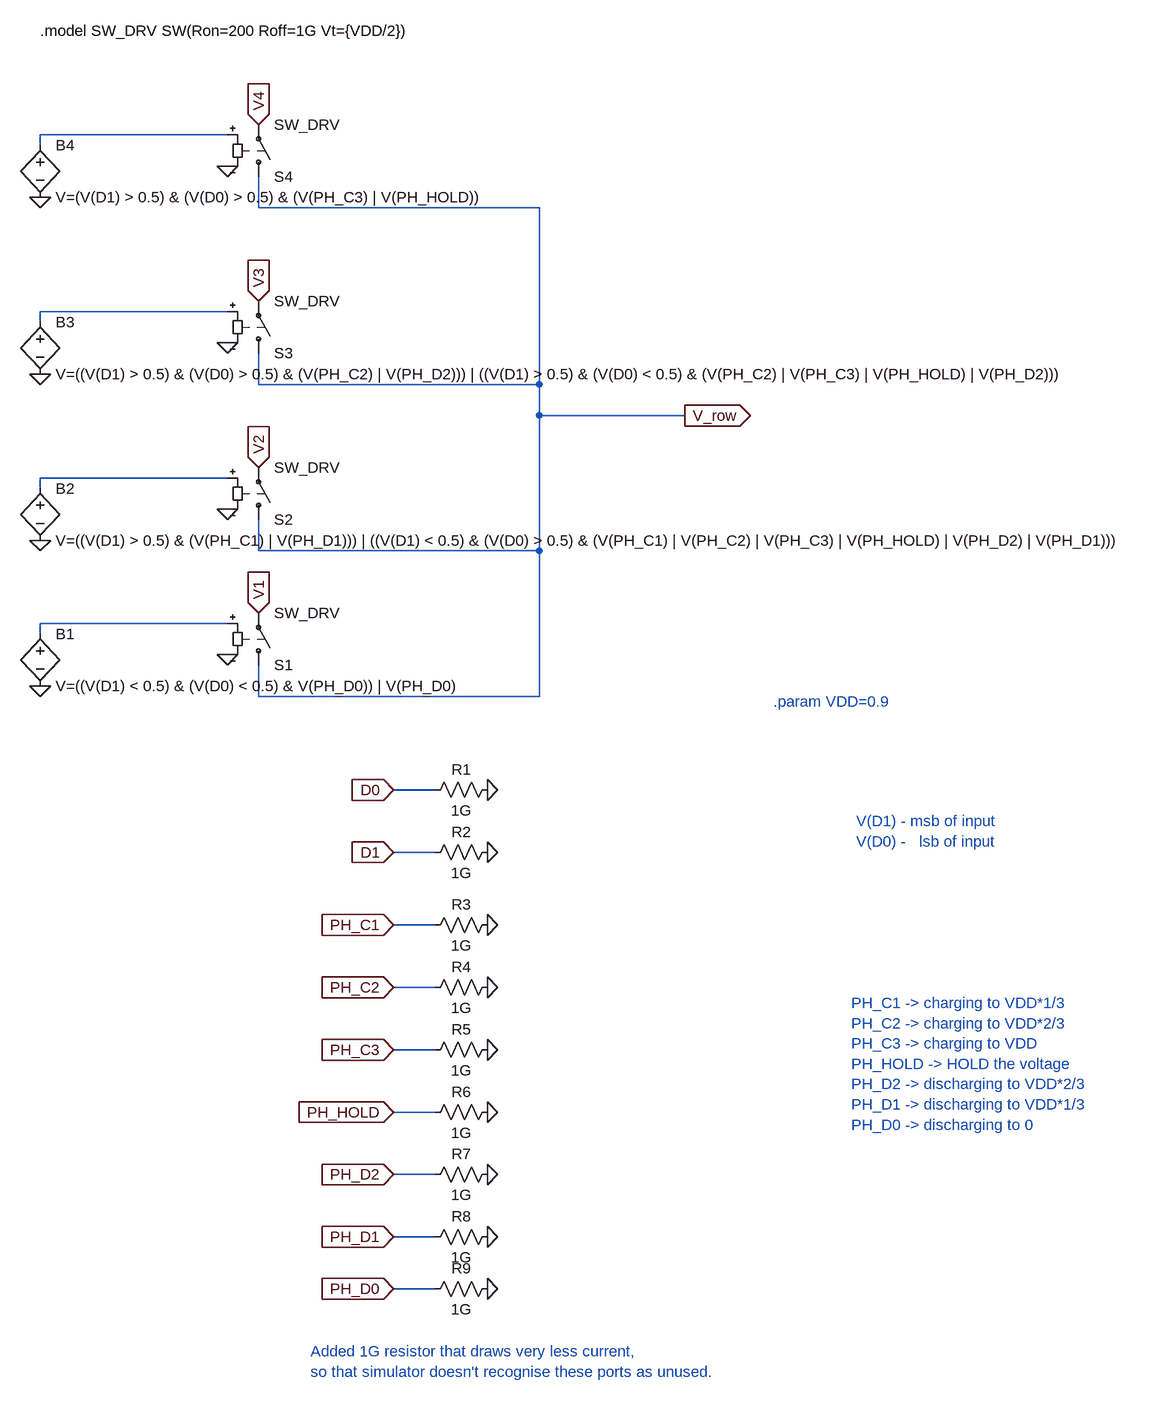
[diagram p0: schematic Stepwise_driver.asc]
Stepwise_driver.asc, the LTspice schematic file:
Version 4
SHEET 1 3396 2868
WIRE 48 960 -240 960
WIRE -240 976 -240 960
WIRE 96 1072 96 1024
WIRE 528 1072 96 1072
WIRE 48 1232 -240 1232
WIRE -240 1248 -240 1232
WIRE 96 1344 96 1296
WIRE 528 1344 528 1072
WIRE 528 1344 96 1344
WIRE 528 1392 528 1344
WIRE 752 1392 528 1392
WIRE 48 1488 -240 1488
WIRE -240 1504 -240 1488
WIRE 96 1600 96 1552
WIRE 528 1600 528 1392
WIRE 528 1600 96 1600
WIRE 48 1712 -240 1712
WIRE -240 1728 -240 1712
WIRE 96 1824 96 1776
WIRE 528 1824 528 1600
WIRE 528 1824 96 1824
WIRE 368 1968 304 1968
WIRE 368 2064 304 2064
WIRE 368 2176 304 2176
WIRE 368 2272 304 2272
WIRE 368 2368 304 2368
WIRE 368 2464 304 2464
WIRE 368 2560 304 2560
WIRE 368 2656 304 2656
WIRE 368 2736 304 2736
FLAG 48 1008 0
FLAG 48 1280 0
FLAG 48 1536 0
FLAG 48 1760 0
FLAG 96 944 V4
IOPIN 96 944 In
FLAG 96 1216 V3
IOPIN 96 1216 In
FLAG 96 1472 V2
IOPIN 96 1472 In
FLAG 96 1696 V1
IOPIN 96 1696 In
FLAG 752 1392 V_row
IOPIN 752 1392 Out
FLAG -240 1056 0
FLAG -240 1328 0
FLAG -240 1584 0
FLAG -240 1808 0
FLAG 304 1968 D0
IOPIN 304 1968 In
FLAG 304 2064 D1
IOPIN 304 2064 In
FLAG 304 2176 PH_C1
IOPIN 304 2176 In
FLAG 304 2272 PH_C2
IOPIN 304 2272 In
FLAG 304 2368 PH_C3
IOPIN 304 2368 In
FLAG 304 2464 PH_HOLD
IOPIN 304 2464 In
FLAG 304 2656 PH_D1
IOPIN 304 2656 In
FLAG 304 2736 PH_D0
IOPIN 304 2736 In
FLAG 304 2560 PH_D2
IOPIN 304 2560 In
FLAG 448 1968 0
FLAG 448 2064 0
FLAG 448 2176 0
FLAG 448 2272 0
FLAG 448 2368 0
FLAG 448 2464 0
FLAG 448 2560 0
FLAG 448 2656 0
FLAG 448 2736 0
SYMBOL sw 96 1040 M180
SYMATTR InstName S4
SYMATTR Value SW_DRV
SYMBOL sw 96 1312 M180
SYMATTR InstName S3
SYMATTR Value SW_DRV
SYMBOL sw 96 1568 M180
SYMATTR InstName S2
SYMATTR Value SW_DRV
SYMBOL sw 96 1792 M180
SYMATTR InstName S1
SYMATTR Value SW_DRV
SYMBOL bv -240 1712 R0
SYMATTR InstName B1
SYMATTR Value V=((V(D1) < 0.5) & (V(D0) < 0.5) & V(PH_D0)) | V(PH_D0)
SYMBOL bv -240 1488 R0
SYMATTR InstName B2
SYMATTR Value V=((V(D1) > 0.5) & (V(PH_C1) | V(PH_D1))) | ((V(D1) < 0.5) & (V(D0) > 0.5) & (V(PH_C1) | V(PH_C2) | V(PH_C3) | V(PH_HOLD) | V(PH_D2) | V(PH_D1)))
SYMBOL bv -240 1232 R0
SYMATTR InstName B3
SYMATTR Value V=((V(D1) > 0.5) & (V(D0) > 0.5) & (V(PH_C2) | V(PH_D2))) | ((V(D1) > 0.5) & (V(D0) < 0.5) & (V(PH_C2) | V(PH_C3) | V(PH_HOLD) | V(PH_D2)))
SYMBOL bv -240 960 R0
SYMATTR InstName B4
SYMATTR Value V=(V(D1) > 0.5) & (V(D0) > 0.5) & (V(PH_C3) | V(PH_HOLD))
SYMBOL Res 352 1984 R270
WINDOW 0 32 56 VTop 2
WINDOW 3 0 56 VBottom 2
SYMATTR InstName R1
SYMATTR Value 1G
SYMBOL Res 352 2080 R270
WINDOW 0 32 56 VTop 2
WINDOW 3 0 56 VBottom 2
SYMATTR InstName R2
SYMATTR Value 1G
SYMBOL Res 352 2192 R270
WINDOW 0 32 56 VTop 2
WINDOW 3 0 56 VBottom 2
SYMATTR InstName R3
SYMATTR Value 1G
SYMBOL Res 352 2288 R270
WINDOW 0 32 56 VTop 2
WINDOW 3 0 56 VBottom 2
SYMATTR InstName R4
SYMATTR Value 1G
SYMBOL Res 352 2384 R270
WINDOW 0 32 56 VTop 2
WINDOW 3 0 56 VBottom 2
SYMATTR InstName R5
SYMATTR Value 1G
SYMBOL Res 352 2480 R270
WINDOW 0 32 56 VTop 2
WINDOW 3 0 56 VBottom 2
SYMATTR InstName R6
SYMATTR Value 1G
SYMBOL Res 352 2576 R270
WINDOW 0 32 56 VTop 2
WINDOW 3 0 56 VBottom 2
SYMATTR InstName R7
SYMATTR Value 1G
SYMBOL Res 352 2672 R270
WINDOW 0 32 56 VTop 2
WINDOW 3 0 56 VBottom 2
SYMATTR InstName R8
SYMATTR Value 1G
SYMBOL Res 352 2752 R270
WINDOW 0 32 56 VTop 2
WINDOW 3 0 56 VBottom 2
SYMATTR InstName R9
SYMATTR Value 1G
TEXT -240 800 Left 2 !.model SW_DRV SW(Ron=200 Roff=1G Vt={VDD/2})
TEXT 1008 2296 Left 2 ;PH_C1 -> charging to VDD*1/3\nPH_C2 -> charging to VDD*2/3\nPH_C3 -> charging to VDD\nPH_HOLD -> HOLD the voltage \nPH_D2 -> discharging to VDD*2/3\nPH_D1 -> discharging to VDD*1/3\nPH_D0 -> discharging to 0
TEXT 1016 2016 Left 2 ;V(D1) - msb of input \nV(D0) -   lsb of input
TEXT 176 2832 Left 2 ;Added 1G resistor that draws very less current, \nso that simulator doesn't recognise these ports as unused.
TEXT 888 1832 Left 2 ;.param VDD=0.9

The netlist it stands for:
* Stepwise_driver.asc
S4 V_row V4 N001 0 SW_DRV
S3 V_row V3 N002 0 SW_DRV
S2 V_row V2 N003 0 SW_DRV
S1 V_row V1 N004 0 SW_DRV
B1 N004 0 V=((V(D1) < 0.5) & (V(D0) < 0.5) & V(PH_D0)) | V(PH_D0)
B2 N003 0 V=((V(D1) > 0.5) & (V(PH_C1) | V(PH_D1))) | ((V(D1) < 0.5) & (V(D0) > 0.5) & (V(PH_C1) | V(PH_C2) | V(PH_C3) | V(PH_HOLD) | V(PH_D2) | V(PH_D1)))
B3 N002 0 V=((V(D1) > 0.5) & (V(D0) > 0.5) & (V(PH_C2) | V(PH_D2))) | ((V(D1) > 0.5) & (V(D0) < 0.5) & (V(PH_C2) | V(PH_C3) | V(PH_HOLD) | V(PH_D2)))
B4 N001 0 V=(V(D1) > 0.5) & (V(D0) > 0.5) & (V(PH_C3) | V(PH_HOLD))
R1 D0 0 1G
R2 D1 0 1G
R3 PH_C1 0 1G
R4 PH_C2 0 1G
R5 PH_C3 0 1G
R6 PH_HOLD 0 1G
R7 PH_D2 0 1G
R8 PH_D1 0 1G
R9 PH_D0 0 1G
.model SW_DRV SW(Ron=200 Roff=1G Vt={VDD/2})
* PH_C1 -> charging to VDD*1/3
* PH_C2 -> charging to VDD*2/3
* PH_C3 -> charging to VDD
* PH_HOLD -> HOLD the voltage
* PH_D2 -> discharging to VDD*2/3
* PH_D1 -> discharging to VDD*1/3
* PH_D0 -> discharging to 0
* V(D1) - msb of input
* V(D0) -   lsb of input
* Added 1G resistor that draws very less current,
* so that simulator doesn't recognise these ports as unused.
* .param VDD=0.9
.backanno
.end